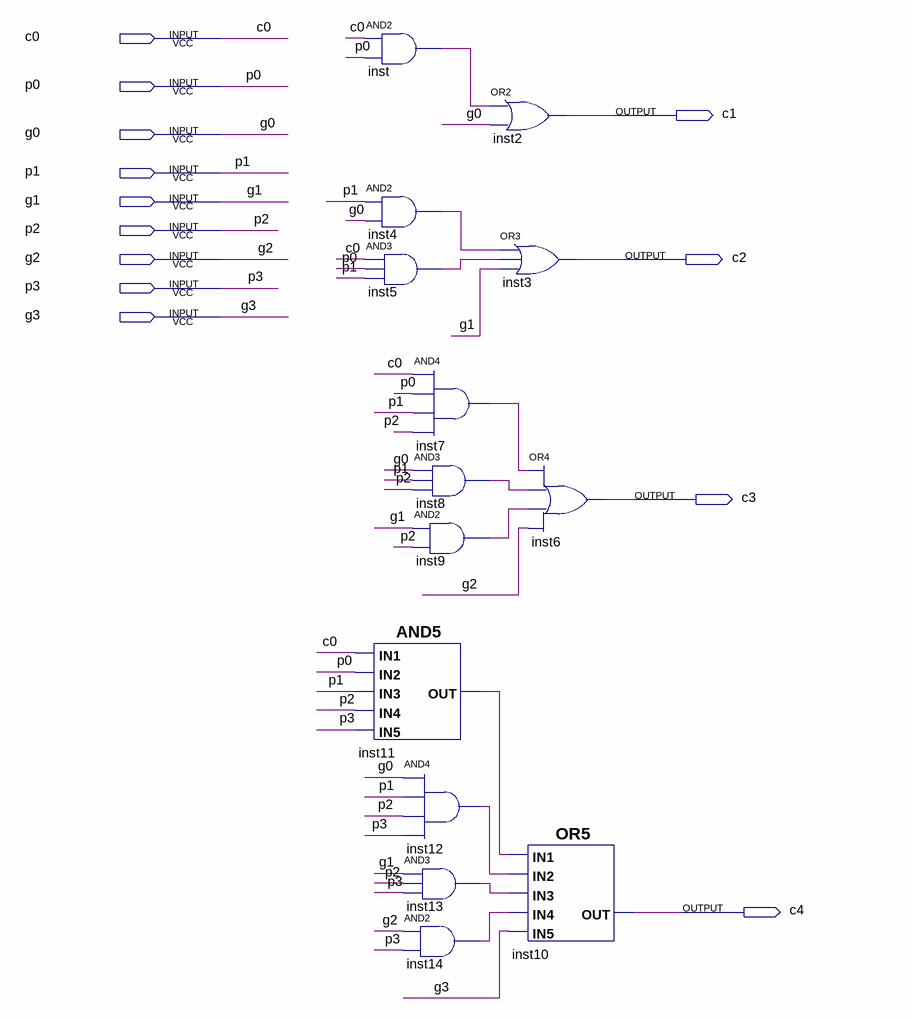
[diagram p0: schematic sheet]
// Quartus schematic AC.bdf as structural Verilog: 14 symbols, 13 pins
module AC (
  input  c0,
  input  p0,
  input  g0,
  input  p1,
  input  g1,
  input  p2,
  input  g2,
  input  p3,
  input  g3,
  output c1,
  output c2,
  output c3,
  output c4
);

  wire inst4_out, inst5_out, inst7_out, inst8_out, inst9_out, inst11_out, inst12_out, inst13_out, inst14_out,
       inst_out;

  and inst (inst_out, c0, p0);
  and inst4 (inst4_out, p1, g0);
  and inst5 (inst5_out, c0, p0, p1);
  and inst7 (inst7_out, c0, p0, p1, p2);
  and inst8 (inst8_out, g0, p1, p2);
  and inst9 (inst9_out, g1, p2);
  and inst11 (inst11_out, c0, p0, p1, p2, p3);
  and inst12 (inst12_out, g0, p1, p2, p3);
  and inst13 (inst13_out, g1, p2, p3);
  and inst14 (inst14_out, g2, p3);
  or inst2 (c1, inst_out, g0);
  or inst3 (c2, inst4_out, inst5_out, g1);
  or inst6 (c3, inst7_out, inst8_out, inst9_out, g2);
  or inst10 (c4, inst11_out, inst12_out, inst13_out, inst14_out, g3);
endmodule
